# Altium schematic sheet bot.SchDoc
size 431 x 241 mm; SheetNumber: 2; SheetTotal: 8
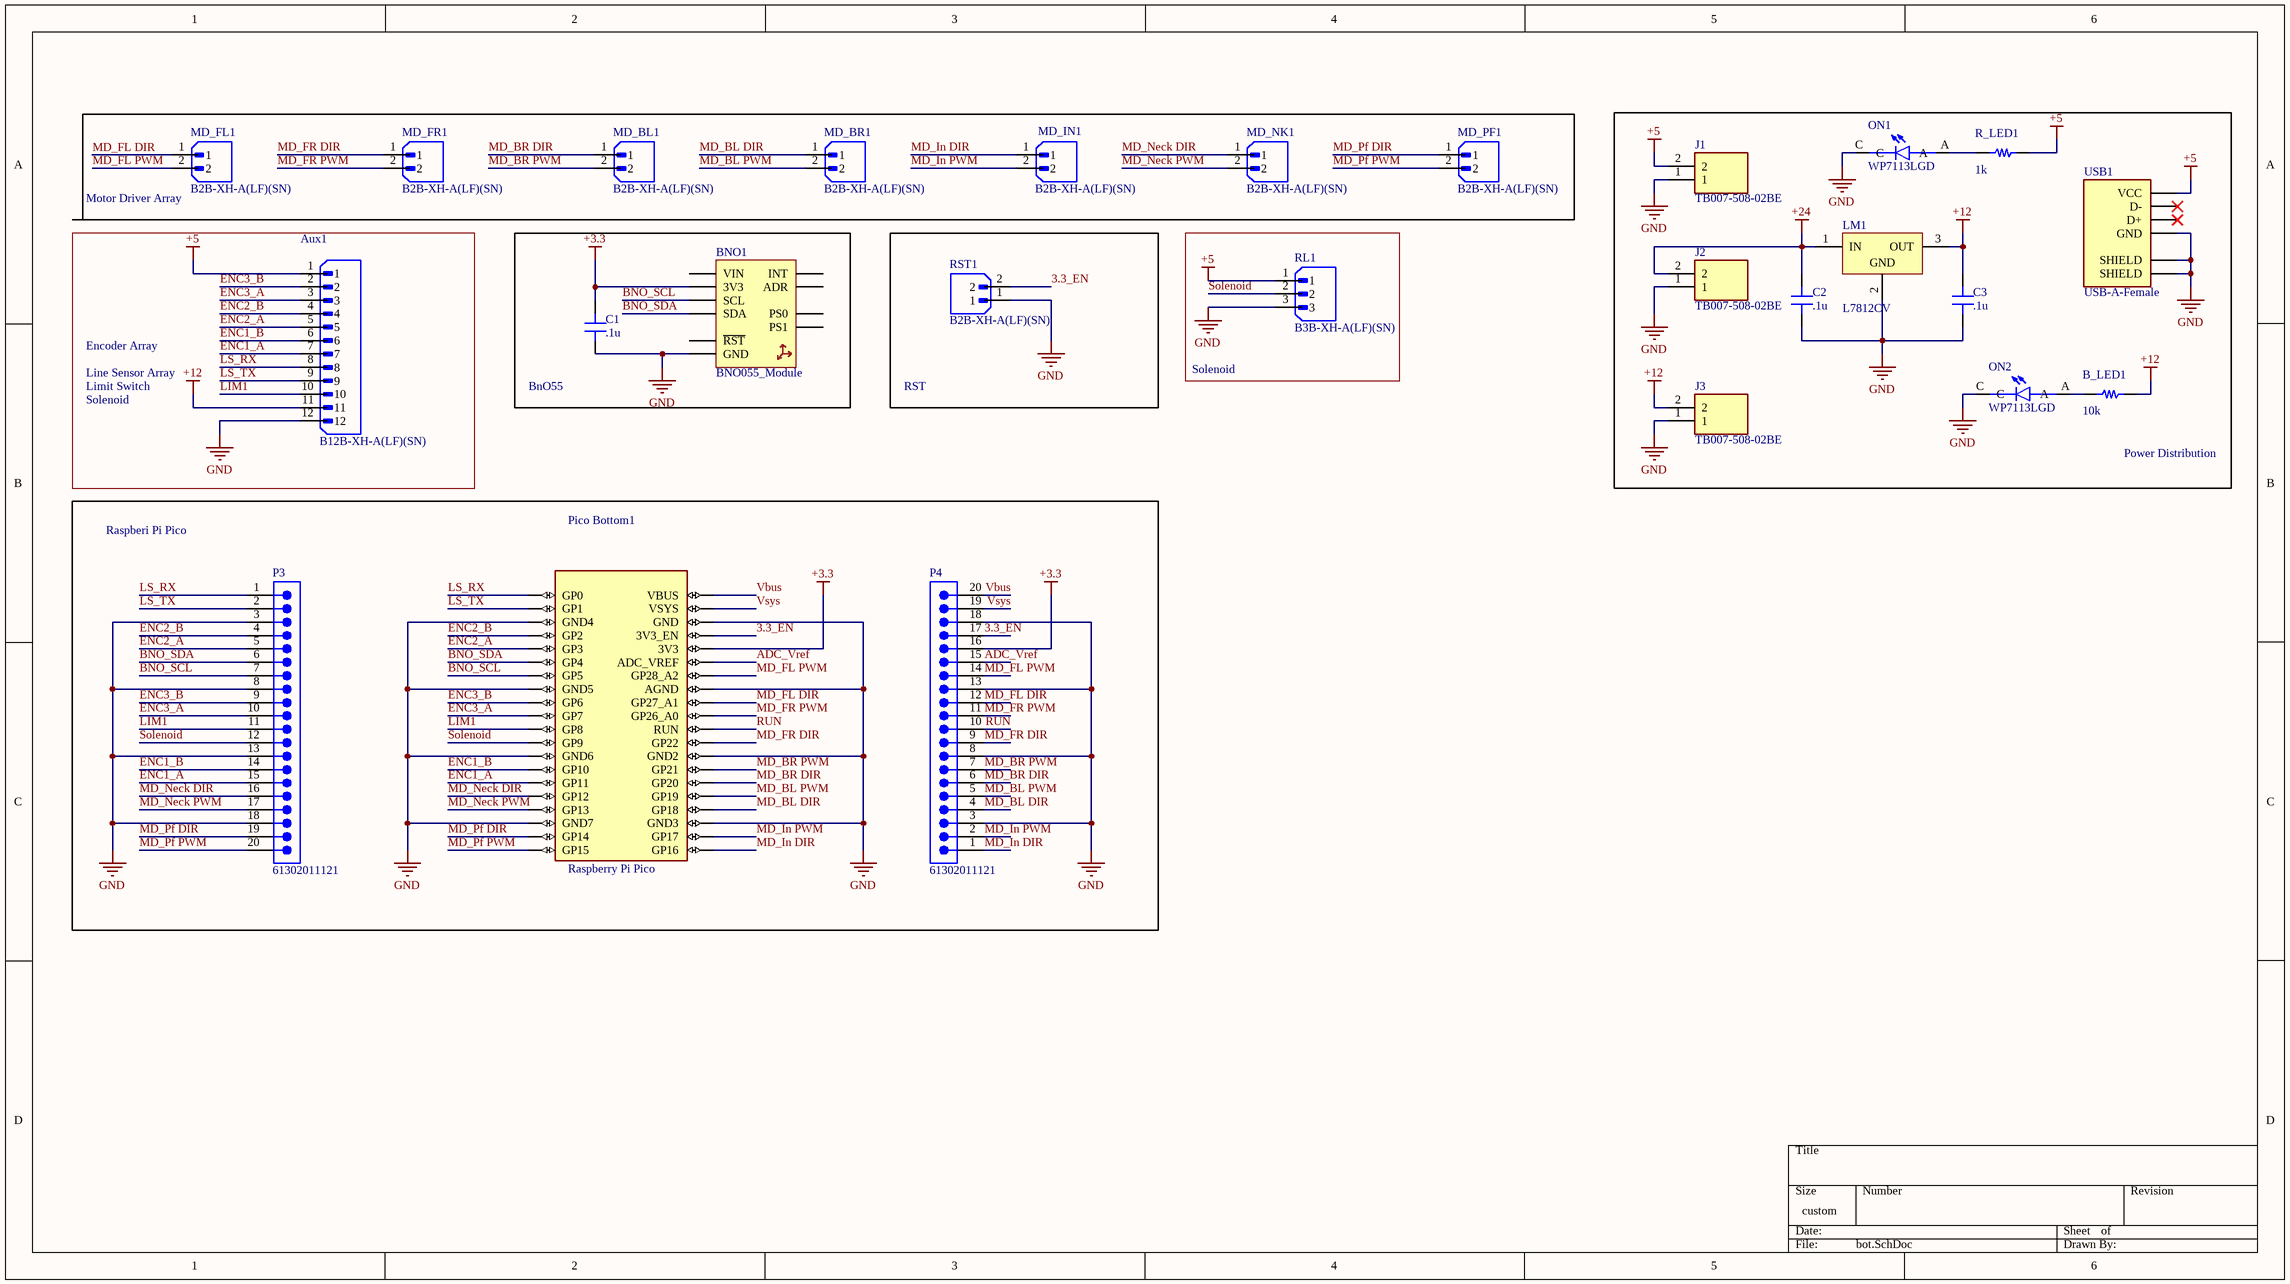
[diagram p0: bot.SchDoc]

## Parts
Aux1  B12B-XH-A(LF)(SN)  [JST_B12B-XH-A(LF)(SN)]
B_LED1  10k  [generic_res_footprint]
BNO1  BNO055_Module  [BNO055_Modiule-Footprint-1]
C1  .1u  [generic_cap]
C2  .1u  [generic_cap]
C3  .1u  [generic_cap]
J1  TB007-508-02BE  [CUI_TB007-508-02BE]
J2  TB007-508-02BE  [CUI_TB007-508-02BE]
J3  TB007-508-02BE  [CUI_TB007-508-02BE]
LM1  L7812CV  [L7812_footprint]
MD_BL1  B2B-XH-A(LF)(SN)  [JST_B2B-XH-A(LF)(SN)]
MD_BR1  B2B-XH-A(LF)(SN)  [JST_B2B-XH-A(LF)(SN)]
MD_FL1  B2B-XH-A(LF)(SN)  [JST_B2B-XH-A(LF)(SN)]
MD_FR1  B2B-XH-A(LF)(SN)  [JST_B2B-XH-A(LF)(SN)]
MD_IN1  B2B-XH-A(LF)(SN)  [JST_B2B-XH-A(LF)(SN)]
MD_NK1  B2B-XH-A(LF)(SN)  [JST_B2B-XH-A(LF)(SN)]
MD_PF1  B2B-XH-A(LF)(SN)  [JST_B2B-XH-A(LF)(SN)]
ON1  WP7113LGD  [LED_WP7113LGD]
ON2  WP7113LGD  [LED_WP7113LGD]
P3  61302011121  [61302011121]
P4  61302011121  [61302011121]
Pico_Bottom1  Raspberry Pi Pico  [RASPBERRY_PI_PICO]
R_LED1  1k  [generic_res_footprint]
RL1  B3B-XH-A(LF)(SN)  [JST_B3B-XH-A(LF)(SN)]
RST1  B2B-XH-A(LF)(SN)  [JST_B2B-XH-A(LF)(SN)]
USB1  USB-A-Female  [CUI_UJ2-AH-4-TH]

## Blocks framed on the sheet
Power Distribution: B_LED1 C2 C3 J1-J3 LM1 ON1 ON2 R_LED1 USB1
BnO55: BNO1 C1
RST: RST1
Solenoid: RL1
Raspberi Pi Pico: P3 P4 Pico_Bottom1

## Nets
+3.3: BNO1.1(3V3) C1.2 P4.16 Pico_Bottom1.3V3
+5: Aux1.1 J1.2 R_LED1.2 RL1.1 USB1.1(VCC)
+12: Aux1.11 B_LED1.2 C3.2 J3.2 LM1.3(OUT)
+24: C2.2 J2.2 LM1.1(IN)
GND: Aux1.12 BNO1.5(GND) C1.1 C2.1 C3.1 J1.1 J2.1 J3.1 LM1.2(GND) ON1.C ON2.C P3.3 P3.8 P3.13 P3.18 P4.3 P4.8 P4.13 P4.18 Pico_Bottom1.AGND Pico_Bottom1.GND Pico_Bottom1.GND2 Pico_Bottom1.GND3 Pico_Bottom1.GND4 Pico_Bottom1.GND5 Pico_Bottom1.GND6 Pico_Bottom1.GND7 RL1.3 RST1.1 USB1.4(GND) USB1.SH1(SHIELD) USB1.SH2(SHIELD)
3.3_EN: P4.17 Pico_Bottom1.3V3_EN RST1.2
ADC_Vref: P4.15 Pico_Bottom1.ADC_VREF
BNO_SCL: BNO1.2(SCL) P3.7 Pico_Bottom1.GP5
BNO_SDA: BNO1.3(SDA) P3.6 Pico_Bottom1.GP4
ENC1_A: Aux1.7 P3.15 Pico_Bottom1.GP11
ENC1_B: Aux1.6 P3.14 Pico_Bottom1.GP10
ENC2_A: Aux1.5 P3.5 Pico_Bottom1.GP3
ENC2_B: Aux1.4 P3.4 Pico_Bottom1.GP2
ENC3_A: Aux1.3 P3.10 Pico_Bottom1.GP7
ENC3_B: Aux1.2 P3.9 Pico_Bottom1.GP6
LIM1: Aux1.10 P3.11 Pico_Bottom1.GP8
LS_RX: Aux1.8 P3.1 Pico_Bottom1.GP0
LS_TX: Aux1.9 P3.2 Pico_Bottom1.GP1
MD_BL DIR: MD_BR1.1 P4.4 Pico_Bottom1.GP18
MD_BL PWM: MD_BR1.2 P4.5 Pico_Bottom1.GP19
MD_BR DIR: MD_BL1.1 P4.6 Pico_Bottom1.GP20
MD_BR PWM: MD_BL1.2 P4.7 Pico_Bottom1.GP21
MD_FL DIR: MD_FL1.1 P4.12 Pico_Bottom1.GP27_A1
MD_FL PWM: MD_FL1.2 P4.14 Pico_Bottom1.GP28_A2
MD_FR DIR: MD_FR1.1 P4.9 Pico_Bottom1.GP22
MD_FR PWM: MD_FR1.2 P4.11 Pico_Bottom1.GP26_A0
MD_In DIR: MD_IN1.1 P4.1 Pico_Bottom1.GP16
MD_In PWM: MD_IN1.2 P4.2 Pico_Bottom1.GP17
MD_Neck DIR: MD_NK1.1 P3.16 Pico_Bottom1.GP12
MD_Neck PWM: MD_NK1.2 P3.17 Pico_Bottom1.GP13
MD_Pf DIR: MD_PF1.1 P3.19 Pico_Bottom1.GP14
MD_Pf PWM: MD_PF1.2 P3.20 Pico_Bottom1.GP15
RUN: P4.10 Pico_Bottom1.RUN
Solenoid: P3.12 Pico_Bottom1.GP9 RL1.2
Vbus: P4.20 Pico_Bottom1.VBUS
Vsys: P4.19 Pico_Bottom1.VSYS
NetB_LED1_1: B_LED1.1 ON2.A
NetON1_A: ON1.A R_LED1.1

Not connected (* = marked no-connect by the designer): BNO1 0(VIN) 4(~{RST}) 6(INT) 7(ADR) 8(PS0) 9(PS1); USB1 2(D-)* 3(D+)*

## Notes on the sheet
- (near MD_FL1) Motor Driver Array
- Encoder Array
- Line Sensor Array
- Solenoid
- Limit Switch

## Library data of the parts
Aux1 = CMP-398-000513-1: Connector Header Through Hole 12 position 0.098 (2.50mm); MF: JST Sales; Package: None; SnapEDA_Link: https://www.snapeda.com/parts/B12B-XH-A(LF)(SN)/JST+Sales+America+Inc./view-part/?ref=snap; Source: B12B-XH-A(LF)(SN).SchLib; Check_prices: https://www.snapeda.com/parts/B12B-XH-A(LF)(SN)/JST+Sales+America+Inc./view-part/?ref=eda; Value: *; Design Item ID: B12B-XH-A(LF)(SN); MP: B12B-XH-A(LF)(SN); Pin Count: 12; Component Type: Standard
B_LED1 R_LED1 = CMP-340-000000-2: Generic through hole resistor
BNO1 = CMP-00055-2: Module for Bosch BNO055 9 axis precision IMU
C1-C3 = CMP-396-000000-3: Generic Ceramic Capacitor; MP: RDER71H472K0K1H03B; Price: None; Package: None; Value: *; Source: RDER71H472K0K1H03B.SchLib; Design Item ID: RDER71H472K0K1H03B; Pin Count: 2; Component Type: Standard; Availability: Unavailable
J1-J3 = CMP-390-000000-3: Barrier Strip Terminal Block; MF: {'manufacturer': u'CUI'}; Source: TB007-508-02BE.SchLib; Component Type: Standard; Design Item ID: TB007-508-02BE; Availability: Unavailable; Value: *; Price: None; Pin Count: 2; MP: TB007-508-02BE; Package: None
LM1 = CMP-00056-1: Fixed Positive Standard Regulator, 12V BIPolar, PSFM3; Regulator Type: FIXED POSITIVE SINGLE OUTPUT STANDARD REGULATOR; Surface Mount: No; Output Voltage1-Min: 11.4V; Min Input Voltage: 14.5V; Channels: 1; Output Current1-Max: 1.5A; Output Voltage1-Max: 12.6V; Max Supply Voltage: 30V; Qualification Status: Not Qualified; Terminal Finish: Tin; Operating Temperature, TJ-Min: 0°C; Reach SVHC Compliant: No; Pins: 3; Terminal Form: Through Hole; Terminal Position: SINGLE; Package Style: FLANGE MOUNTMeter; Technology: BIPOLAR; Operating Temperature, TJ-Max: 125°C; Output Voltage1-Nom: 12V; Package Shape: Rectangular; RoHS Compliant: Yes
MD_BL1 MD_BR1 MD_FL1 MD_FR1 MD_IN1 MD_NK1 MD_PF1 RST1 = CMP-332-000000-1: Connector Header Through Hole 2 position 0.098 (2.50mm); MF: JST Sales America Inc.; Component Type: Standard; Value: *; Check_prices: https://www.snapeda.com/parts/B2B-XH-A(LF)(SN)/JST+Sales+America+Inc./view-part/?ref=eda; Package: None; MP: B2B-XH-A(LF)(SN); SnapEDA_Link: https://www.snapeda.com/parts/B2B-XH-A(LF)(SN)/JST+Sales+America+Inc./view-part/?ref=snap; Pin Count: 2; Source: B2B-XH-A(LF)(SN).SchLib; Design Item ID: B2B-XH-A(LF)(SN)
ON1 ON2 = CMP-352-000000-1: Green 568nm LED Indication - Discrete 1.9V Radial; MF: Kingbright; Value: *; Component Type: Standard; Design Item ID: WP7113LGD; Package: Radial Kingbright; Price: None; Source: WP7113LGD.SchLib; SnapEDA_Link: https://www.snapeda.com/parts/WP7113LGD/Kingbright/view-part/?ref=snap; Check_prices: https://www.snapeda.com/parts/WP7113LGD/Kingbright/view-part/?ref=eda; Pin Count: 2; Availability: In Stock; Purchase-URL: https://pricing.snapeda.com/search/part/WP7113LGD/?ref=eda; MP: WP7113LGD
P3 P4 = CMP-398-000243-1: WR-PHD Pin Header, THT, Vertical, pitch 2.54mm, 1 Row, 20P; Manufacturer: Wurth Elektronik; Withstanding Voltage: 500V; Working Voltage: 250V; Rated Current: 3A; Contact Resistance: 20mOhm; ComponentLink2URL: https://www.we-online.com/redexpert/spec/61302011121?ad; Packaging: Bag; Orientation: Vertical; Match Code: WR-PHD; Number of Pins: 20; Number of Rows: 1; Gender: Pin Header; Source: WR-PHD.SchLib; Design Item ID: 61302011121; ComponentLink1Description: Website Link; Operating Temperature Min: -40°C; Manufacturer Part Number: 61302011121; ComponentLink2Description: Datasheet Link; ComponentLink1URL: https://www.we-online.com/redexpert/article/61302011121?ad; Operating Temperature Max: 105°C; Component Type: Standard; Mount: Through Hole; Category: Board-to-Board Connectors; Pin Count: 20; Pitch: 2.54mm
Pico_Bottom1 = CMP-394-000000-2: Raspberry Pi Board, Arm Cortex-M0+; Component Type: Standard; MF: Raspberry Pi; Design Item ID: RASPBERRY_PI_PICO; MP: RASPBERRY PI PICO; SnapEDA_Link: https://www.snapeda.com/parts/RASPBERRY%20PI%20PICO/Raspberry+Pi/view-part/?ref=snap; Check_prices: https://www.snapeda.com/parts/RASPBERRY%20PI%20PICO/Raspberry+Pi/view-part/?ref=eda; Package: None; Source: RASPBERRY_PI_PICO.SchLib; Pin Count: 40; Value: *
RL1 = CMP-330-000000-1: Connector Header Through Hole 3 position 0.098 (2.50mm); MF: JST Sales; Value: *; Check_prices: https://www.snapeda.com/parts/B3B-XH-A(LF)(SN)/JST+Sales+America+Inc./view-part/?ref=eda; Component Type: Standard; Source: B3B-XH-A(LF)(SN).SchLib; MP: B3B-XH-A(LF)(SN); Design Item ID: B3B-XH-A(LF)(SN); SnapEDA_Link: https://www.snapeda.com/parts/B3B-XH-A(LF)(SN)/JST+Sales+America+Inc./view-part/?ref=snap; Pin Count: 3; Package: None
USB1 = CMP-346-000000-8: Type A, USB 2.0, 1 A, Right Angle, Through Hole, USB Receptacle; MF: CUI Devices; Pin Count: 6; Check_prices: https://www.snapeda.com/parts/UJ2-AH-4-TH/CUI+Devices/view-part/?ref=eda; Purchase-URL: https://pricing.snapeda.com/search/part/UJ2-AH-4-TH/?ref=eda; Package: None; Value: *; Component Type: Standard; MP: UJ2-AH-4-TH; Digi-Key_Part_Number: 102-3994-ND; Source: UJ2-AH-4-TH.SchLib; CUI_purchase_URL: https://www.cuidevices.com/product/interconnect/connectors/usb-connectors/uj2-ah-4-th?utm_source=snapeda.com&utm_medium=referral&utm_campaign=snapedaBOM; SnapEDA_Link: https://www.snapeda.com/parts/UJ2-AH-4-TH/CUI+Devices/view-part/?ref=snap; Design Item ID: UJ2-AH-4-TH